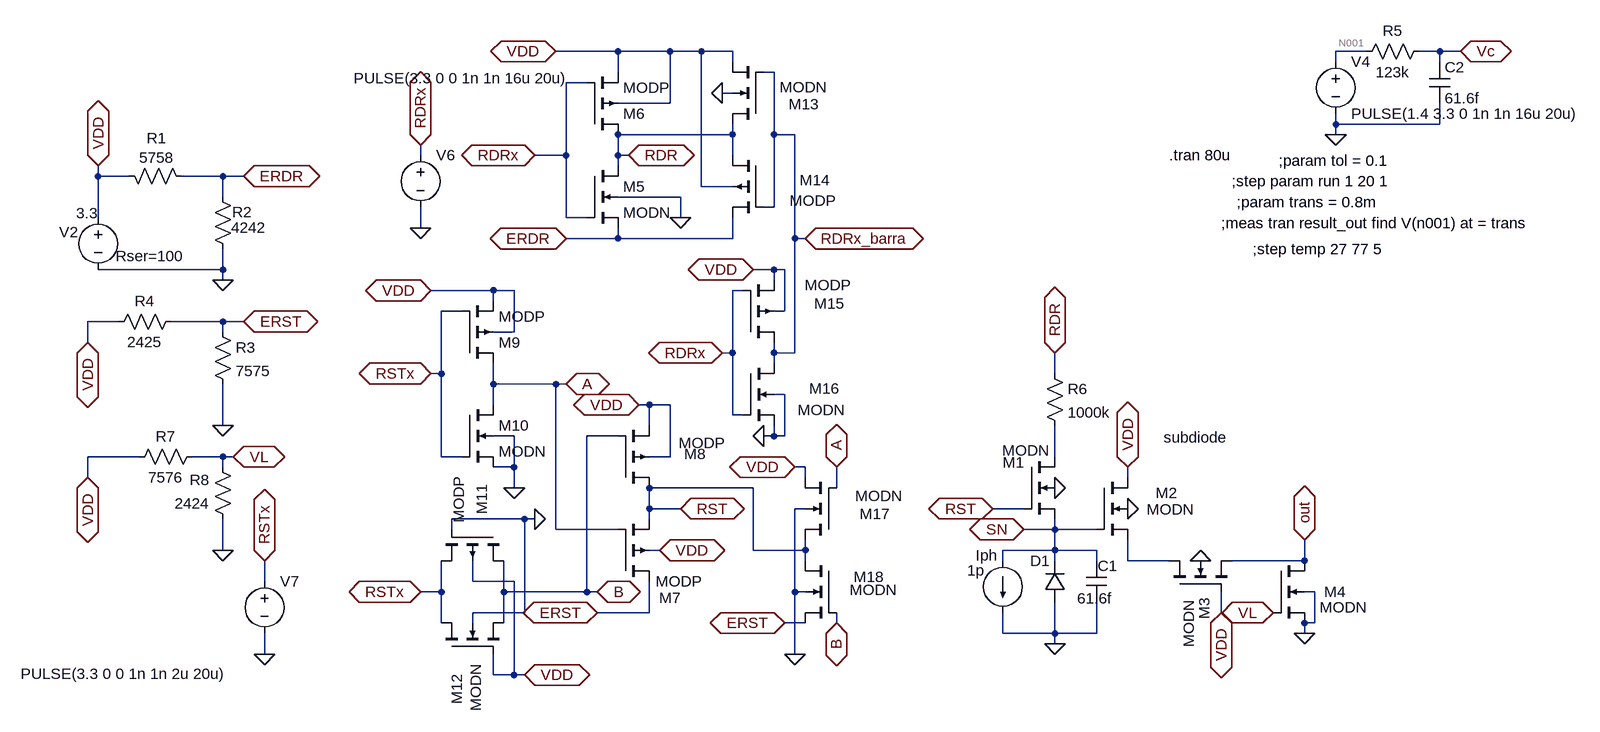
[diagram p0: schematic LIN LOG rdr e rst novo.asc]
LIN LOG rdr e rst novo.asc, the LTspice schematic file:
Version 4
SHEET 1 1868 840
WIRE 336 -5104 240 -5104
WIRE 416 -5104 336 -5104
WIRE 464 -5104 416 -5104
WIRE 512 -5104 464 -5104
WIRE 1488 -5104 1440 -5104
WIRE 1600 -5104 1568 -5104
WIRE 1632 -5104 1600 -5104
WIRE 512 -5088 512 -5104
WIRE 1440 -5088 1440 -5104
WIRE 1600 -5088 1600 -5104
WIRE 336 -5072 336 -5104
WIRE 576 -5072 560 -5072
WIRE 288 -5056 256 -5056
WIRE 512 -5040 496 -5040
WIRE 416 -5024 416 -5104
WIRE 416 -5024 336 -5024
WIRE 1440 -4992 1440 -5008
WIRE 1600 -4992 1600 -5024
WIRE 1600 -4992 1440 -4992
WIRE 512 -4976 512 -4992
WIRE 512 -4976 336 -4976
WIRE 576 -4976 576 -5072
WIRE 608 -4976 576 -4976
WIRE 1440 -4976 1440 -4992
WIRE 32 -4944 32 -4960
WIRE 256 -4944 256 -5056
WIRE 256 -4944 208 -4944
WIRE 336 -4944 336 -4976
WIRE 352 -4944 336 -4944
WIRE 512 -4944 512 -4976
WIRE 336 -4928 336 -4944
WIRE -464 -4912 -464 -4928
WIRE -416 -4912 -464 -4912
WIRE -272 -4912 -336 -4912
WIRE -240 -4912 -272 -4912
WIRE 464 -4896 464 -5104
WIRE 512 -4896 464 -4896
WIRE -272 -4880 -272 -4912
WIRE 432 -4880 336 -4880
WIRE 576 -4864 576 -4976
WIRE 576 -4864 560 -4864
WIRE -464 -4848 -464 -4912
WIRE 256 -4848 256 -4944
WIRE 288 -4848 256 -4848
WIRE 432 -4848 432 -4880
WIRE 32 -4832 32 -4864
WIRE 336 -4816 336 -4832
WIRE 336 -4816 256 -4816
WIRE 512 -4816 512 -4848
WIRE 512 -4816 336 -4816
WIRE 608 -4816 608 -4976
WIRE 624 -4816 608 -4816
WIRE -272 -4768 -272 -4800
WIRE -272 -4768 -464 -4768
WIRE 576 -4768 544 -4768
WIRE 592 -4768 576 -4768
WIRE -272 -4752 -272 -4768
WIRE 576 -4752 576 -4768
WIRE 144 -4736 48 -4736
WIRE 176 -4736 144 -4736
WIRE 528 -4736 512 -4736
WIRE 144 -4720 144 -4736
WIRE 96 -4704 64 -4704
WIRE 592 -4704 592 -4768
WIRE 592 -4704 576 -4704
WIRE -432 -4688 -480 -4688
WIRE -272 -4688 -352 -4688
WIRE -240 -4688 -272 -4688
WIRE -272 -4672 -272 -4688
WIRE 176 -4672 176 -4736
WIRE 176 -4672 144 -4672
WIRE -480 -4656 -480 -4688
WIRE 512 -4640 512 -4736
WIRE 512 -4640 496 -4640
WIRE 576 -4640 576 -4656
WIRE 608 -4640 608 -4816
WIRE 608 -4640 576 -4640
WIRE 576 -4624 576 -4640
WIRE 64 -4608 64 -4704
WIRE 64 -4608 48 -4608
WIRE 1008 -4608 1008 -4640
WIRE 144 -4592 144 -4624
WIRE 240 -4592 144 -4592
WIRE 256 -4592 240 -4592
WIRE 592 -4576 576 -4576
WIRE 144 -4560 144 -4592
WIRE 384 -4560 368 -4560
WIRE 416 -4560 384 -4560
WIRE 512 -4544 512 -4640
WIRE 528 -4544 512 -4544
WIRE -272 -4528 -272 -4592
WIRE 384 -4528 384 -4560
WIRE 176 -4512 144 -4512
WIRE 336 -4512 288 -4512
WIRE 576 -4512 576 -4528
WIRE 576 -4512 560 -4512
WIRE 592 -4512 592 -4576
WIRE 592 -4512 576 -4512
WIRE -400 -4480 -480 -4480
WIRE -272 -4480 -320 -4480
WIRE -256 -4480 -272 -4480
WIRE 64 -4480 64 -4608
WIRE 96 -4480 64 -4480
WIRE 416 -4480 416 -4560
WIRE 416 -4480 384 -4480
WIRE 1008 -4480 1008 -4528
WIRE -272 -4464 -272 -4480
WIRE 176 -4464 176 -4512
WIRE 176 -4464 144 -4464
WIRE 624 -4464 608 -4464
WIRE -480 -4448 -480 -4480
WIRE 624 -4448 624 -4464
WIRE 1120 -4448 1120 -4464
WIRE 176 -4432 176 -4464
WIRE 544 -4432 384 -4432
WIRE 672 -4432 672 -4464
WIRE 384 -4400 384 -4432
WIRE 432 -4400 384 -4400
WIRE 624 -4400 608 -4400
WIRE 960 -4400 912 -4400
WIRE 192 -4384 80 -4384
WIRE 208 -4384 192 -4384
WIRE 384 -4384 384 -4400
WIRE 80 -4368 80 -4384
WIRE 240 -4368 240 -4592
WIRE 336 -4368 240 -4368
WIRE 1008 -4368 1008 -4384
WIRE 1008 -4368 960 -4368
WIRE 1072 -4368 1008 -4368
WIRE -272 -4336 -272 -4384
WIRE 400 -4336 384 -4336
WIRE 544 -4336 544 -4432
WIRE 624 -4336 624 -4352
WIRE 624 -4336 544 -4336
WIRE 1008 -4336 1008 -4368
WIRE 1008 -4336 928 -4336
WIRE 1072 -4336 1008 -4336
WIRE 624 -4320 624 -4336
WIRE 928 -4320 928 -4336
WIRE 1008 -4320 1008 -4336
WIRE 1072 -4320 1072 -4336
WIRE 1120 -4320 1120 -4352
WIRE 1184 -4320 1120 -4320
WIRE 1392 -4320 1392 -4352
WIRE 1392 -4320 1280 -4320
WIRE 1200 -4304 1200 -4320
WIRE -208 -4288 -208 -4320
WIRE 112 -4288 112 -4320
WIRE 176 -4288 112 -4288
WIRE 64 -4272 64 -4320
WIRE 64 -4272 32 -4272
WIRE 160 -4272 160 -4320
WIRE 288 -4272 288 -4512
WIRE 288 -4272 160 -4272
WIRE 304 -4272 288 -4272
WIRE 608 -4272 608 -4400
WIRE 624 -4272 608 -4272
WIRE 1408 -4272 1392 -4272
WIRE 192 -4240 192 -4384
WIRE 192 -4240 112 -4240
WIRE 384 -4240 384 -4288
WIRE 384 -4240 304 -4240
WIRE 1264 -4240 1264 -4272
WIRE 64 -4224 64 -4272
WIRE 112 -4224 112 -4240
WIRE 160 -4224 160 -4272
WIRE 624 -4224 592 -4224
WIRE 672 -4224 672 -4240
WIRE 1392 -4224 1392 -4240
WIRE 1408 -4224 1408 -4272
WIRE 1408 -4224 1392 -4224
WIRE 928 -4208 928 -4240
WIRE 1008 -4208 1008 -4256
WIRE 1008 -4208 928 -4208
WIRE 1072 -4208 1072 -4256
WIRE 1072 -4208 1008 -4208
WIRE 1392 -4208 1392 -4224
WIRE 1008 -4192 1008 -4208
WIRE -208 -4176 -208 -4208
WIRE 608 -4176 608 -4272
WIRE 144 -4144 144 -4176
WIRE 176 -4144 176 -4288
WIRE 176 -4144 144 -4144
WIRE 192 -4144 176 -4144
FLAG 912 -4400 RST
IOPIN 912 -4400 BiDir
FLAG -272 -4752 0
FLAG 1008 -4432 0
FLAG 1008 -4192 0
FLAG 1008 -4640 RDR
IOPIN 1008 -4640 BiDir
FLAG 1120 -4400 0
FLAG 1392 -4208 0
FLAG 1344 -4240 VL
IOPIN 1344 -4240 BiDir
FLAG 1120 -4464 VDD
IOPIN 1120 -4464 BiDir
FLAG 1232 -4320 0
FLAG 1264 -4240 VDD
IOPIN 1264 -4240 BiDir
FLAG 1392 -4352 out
IOPIN 1392 -4352 BiDir
FLAG 960 -4368 SN
IOPIN 960 -4368 BiDir
FLAG -240 -4912 ERDR
IOPIN -240 -4912 BiDir
FLAG 240 -5104 VDD
IOPIN 240 -5104 BiDir
FLAG 432 -4848 0
FLAG 352 -4944 RDR
IOPIN 352 -4944 BiDir
FLAG 208 -4944 RDRx
IOPIN 208 -4944 BiDir
FLAG 256 -4816 ERDR
IOPIN 256 -4816 BiDir
FLAG 32 -4832 0
FLAG 32 -4960 RDRx
IOPIN 32 -4960 BiDir
FLAG 368 -4560 VDD
IOPIN 368 -4560 BiDir
FLAG 432 -4400 RST
IOPIN 432 -4400 BiDir
FLAG 400 -4336 VDD
IOPIN 400 -4336 BiDir
FLAG 304 -4240 ERST
IOPIN 304 -4240 BiDir
FLAG 48 -4736 VDD
IOPIN 48 -4736 BiDir
FLAG 48 -4608 RSTx
IOPIN 48 -4608 BiDir
FLAG 176 -4432 0
FLAG 192 -4144 VDD
IOPIN 192 -4144 BiDir
FLAG 208 -4384 0
FLAG 32 -4272 RSTx
IOPIN 32 -4272 BiDir
FLAG -208 -4320 RSTx
IOPIN -208 -4320 BiDir
FLAG -208 -4176 0
FLAG -272 -4528 0
FLAG -240 -4688 ERST
IOPIN -240 -4688 BiDir
FLAG 1632 -5104 Vc
IOPIN 1632 -5104 BiDir
FLAG 1440 -4976 0
FLAG -480 -4656 VDD
IOPIN -480 -4656 BiDir
FLAG -272 -4336 0
FLAG -480 -4448 VDD
IOPIN -480 -4448 BiDir
FLAG -256 -4480 VL
IOPIN -256 -4480 BiDir
FLAG -464 -4928 VDD
IOPIN -464 -4928 BiDir
FLAG 496 -5040 0
FLAG 544 -4768 VDD
IOPIN 544 -4768 BiDir
FLAG 560 -4512 0
FLAG 624 -4816 RDRx_barra
IOPIN 624 -4816 BiDir
FLAG 496 -4640 RDRx
IOPIN 496 -4640 BiDir
FLAG 608 -4176 0
FLAG 608 -4464 VDD
IOPIN 608 -4464 BiDir
FLAG 256 -4592 A
IOPIN 256 -4592 BiDir
FLAG 672 -4464 A
IOPIN 672 -4464 BiDir
FLAG 304 -4272 B
IOPIN 304 -4272 BiDir
FLAG 672 -4224 B
IOPIN 672 -4224 BiDir
FLAG 592 -4224 ERST
IOPIN 592 -4224 BiDir
SYMBOL voltage -464 -4864 R0
WINDOW 123 0 0 Left 2
WINDOW 39 27 75 Left 2
WINDOW 0 -60 38 Left 2
WINDOW 3 -34 9 Left 2
SYMATTR SpiceLine Rser=100
SYMATTR InstName V2
SYMATTR Value 3.3
SYMBOL nmos4 960 -4480 R0
WINDOW 0 -32 9 Left 2
WINDOW 3 -33 -10 Left 2
SYMATTR InstName M1
SYMATTR Value MODN
SYMATTR Value2 l=0.35u w=0.70u
SYMBOL nmos4 1072 -4448 R0
WINDOW 3 77 49 Left 2
WINDOW 0 91 24 Left 2
SYMATTR Value MODN
SYMATTR InstName M2
SYMATTR Value2 l=0.35u w=0.70u
SYMBOL nmos4 1344 -4320 R0
WINDOW 0 78 48 Left 2
WINDOW 3 71 72 Left 2
SYMATTR InstName M4
SYMATTR Value MODN
SYMATTR Value2 l=0.35u w=0.70u
SYMBOL diode 1024 -4256 R180
WINDOW 0 23 64 Left 2
WINDOW 3 -250 254 Left 2
SYMATTR InstName D1
SYMATTR Value subdiode
SYMBOL current 928 -4320 R0
WINDOW 3 -55 15 Left 2
WINDOW 123 0 0 Left 2
WINDOW 39 0 0 Left 2
WINDOW 0 -42 -8 Left 2
SYMATTR Value 1p
SYMATTR InstName Iph
SYMBOL nmos4 1184 -4272 R270
WINDOW 0 -43 54 Left 2
WINDOW 3 -86 30 Left 2
SYMATTR InstName M3
SYMATTR Value MODN
SYMATTR Value2 l=0.35u w=0.70u
SYMBOL res -432 -4928 M90
WINDOW 0 -27 58 VBottom 2
WINDOW 3 -28 58 VTop 2
SYMATTR InstName R1
SYMATTR Value 5758
SYMBOL res -256 -4784 R180
WINDOW 0 -29 73 Left 2
WINDOW 3 -51 49 Left 2
SYMATTR InstName R2
SYMATTR Value 4242
SYMBOL nmos4 288 -4928 R0
SYMATTR InstName M5
SYMATTR Value MODN
SYMATTR Value2 l=0.35u w=0.70u
SYMBOL pmos4 288 -4976 M180
SYMATTR InstName M6
SYMATTR Value MODP
SYMATTR Value2 l=0.35u w=0.70u
SYMBOL voltage 32 -4960 R0
WINDOW 3 -103 -103 Left 2
WINDOW 123 0 0 Left 2
WINDOW 39 0 0 Left 2
SYMATTR Value PULSE(3.3 0 0 1n 1n 16u 20u)
SYMATTR InstName V6
SYMBOL pmos4 336 -4288 M180
WINDOW 0 63 -25 Left 2
WINDOW 3 58 0 Left 2
SYMATTR InstName M7
SYMATTR Value MODP
SYMATTR Value2 l=0.35u w=0.70u
SYMBOL pmos4 336 -4432 M180
WINDOW 0 102 52 Left 2
WINDOW 3 93 69 Left 2
SYMATTR InstName M8
SYMATTR Value MODP
SYMATTR Value2 l=0.35u w=0.70u
SYMBOL pmos4 96 -4624 M180
SYMATTR InstName M9
SYMATTR Value MODP
SYMATTR Value2 l=0.35u w=0.70u
SYMBOL nmos4 96 -4560 R0
SYMATTR InstName M10
SYMATTR Value MODN
SYMATTR Value2 l=0.35u w=0.70u
SYMBOL pmos4 160 -4368 R90
WINDOW 0 -70 34 Left 2
WINDOW 3 -82 69 Left 2
SYMATTR InstName M11
SYMATTR Value MODP
SYMATTR Value2 l=0.35u w=0.70u
SYMBOL nmos4 64 -4176 R270
WINDOW 0 -77 24 Left 2
WINDOW 3 -88 53 Left 2
SYMATTR InstName M12
SYMATTR Value MODN
SYMATTR Value2 l=0.35u w=0.70u
SYMBOL voltage -208 -4304 R0
WINDOW 3 -375 158 Left 2
WINDOW 123 0 0 Left 2
WINDOW 39 0 0 Left 2
SYMATTR Value PULSE(3.3 0 0 1n 1n 2u 20u)
SYMATTR InstName V7
SYMBOL res -288 -4688 R0
SYMATTR InstName R3
SYMATTR Value 7575
SYMBOL res -336 -4704 R90
WINDOW 0 0 56 VBottom 2
WINDOW 3 32 56 VTop 2
SYMATTR InstName R4
SYMATTR Value 2425
SYMBOL cap 1056 -4320 R0
WINDOW 3 -14 58 Left 2
WINDOW 0 18 8 Left 2
SYMATTR Value 61.6f
SYMATTR InstName C1
SYMBOL res 1584 -5120 R90
WINDOW 0 0 56 VBottom 2
WINDOW 3 32 56 VTop 2
SYMATTR InstName R5
SYMATTR Value 123k
SYMBOL cap 1584 -5088 R0
SYMATTR InstName C2
SYMATTR Value 61.6f
SYMBOL voltage 1440 -5104 R0
WINDOW 123 0 0 Left 2
WINDOW 39 0 0 Left 2
SYMATTR InstName V4
SYMATTR Value PULSE(1.4 3.3 0 1n 1n 16u 20u)
SYMBOL res -304 -4496 R90
WINDOW 0 0 56 VBottom 2
WINDOW 3 32 56 VTop 2
SYMATTR InstName R7
SYMATTR Value 7576
SYMBOL res -256 -4368 R180
WINDOW 0 36 76 Left 2
WINDOW 3 36 40 Left 2
SYMATTR InstName R8
SYMATTR Value 2424
SYMBOL res 992 -4624 R0
SYMATTR InstName R6
SYMATTR Value 1000k
SYMBOL nmos4 560 -4992 R180
WINDOW 0 -86 31 Left 2
WINDOW 3 -98 57 Left 2
SYMATTR InstName M13
SYMATTR Value MODN
SYMATTR Value2 l=0.35u w=0.7u
SYMBOL pmos4 560 -4944 M0
WINDOW 0 -103 38 Left 2
WINDOW 3 -112 70 Left 2
SYMATTR InstName M14
SYMATTR Value MODP
SYMATTR Value2 l=0.35u w=0.7u
SYMBOL pmos4 528 -4656 M180
WINDOW 0 110 60 Left 2
WINDOW 3 95 88 Left 2
SYMATTR InstName M15
SYMATTR Value MODP
SYMATTR Value2 l=0.35u w=0.7u
SYMBOL nmos4 528 -4624 R0
WINDOW 0 102 39 Left 2
WINDOW 3 84 72 Left 2
SYMATTR InstName M16
SYMATTR Value MODN
SYMATTR Value2 l=0.35u w=0.7u
SYMBOL nmos4 672 -4352 R180
WINDOW 0 -83 40 Left 2
WINDOW 3 -102 68 Left 2
SYMATTR InstName M17
SYMATTR Value MODN
SYMATTR Value2 l=0.35u w=0.7u
SYMBOL nmos4 672 -4320 M0
WINDOW 0 -74 25 Left 2
WINDOW 3 -94 45 Left 2
SYMATTR InstName M18
SYMATTR Value MODN
SYMATTR Value2 l=0.35u w=0.7u
TEXT 1184 -4944 Left 2 !.tran 80u
TEXT 1352 -4936 Left 2 !;param tol = 0.1
TEXT 1280 -4904 Left 2 !;step param run 1 20 1
TEXT 1288 -4872 Left 2 !;param trans = 0.8m
TEXT 1264 -4840 Left 2 !;meas tran result_out find V(n001) at = trans
TEXT 1312 -4800 Left 2 !;step temp 27 77 5

The netlist it stands for:
* LIN LOG rdr e rst novo.asc
V2 VDD 0 3.3 Rser=100
M1 N002 RST SN 0 MODN l=0.35u w=0.70u
M2 VDD SN N003 0 MODN l=0.35u w=0.70u
M4 out VL 0 0 MODN l=0.35u w=0.70u
D1 0 SN subdiode
Iph SN 0 1p
M3 N003 VDD out 0 MODN l=0.35u w=0.70u
R1 VDD ERDR 5758
R2 0 ERDR 4242
M5 RDR RDRx ERDR 0 MODN l=0.35u w=0.70u
M6 RDR RDRx VDD VDD MODP l=0.35u w=0.70u
V6 RDRx 0 PULSE(3.3 0 0 1n 1n 16u 20u)
M7 ERST A RST VDD MODP l=0.35u w=0.70u
M8 RST B VDD VDD MODP l=0.35u w=0.70u
M9 A RSTx VDD VDD MODP l=0.35u w=0.70u
M10 A RSTx 0 0 MODN l=0.35u w=0.70u
M11 B 0 RSTx VDD MODP l=0.35u w=0.70u
M12 RSTx VDD B 0 MODN l=0.35u w=0.70u
V7 RSTx 0 PULSE(3.3 0 0 1n 1n 2u 20u)
R3 ERST 0 7575
R4 ERST VDD 2425
C1 SN 0 61.6f
R5 Vc N001 123k
C2 Vc 0 61.6f
V4 N001 0 PULSE(1.4 3.3 0 1n 1n 16u 20u)
R7 VL VDD 7576
R8 0 VL 2424
R6 RDR N002 1000k
M13 RDR RDRx_barra VDD 0 MODN l=0.35u w=0.7u
M14 RDR RDRx_barra ERDR VDD MODP l=0.35u w=0.7u
M15 RDRx_barra RDRx VDD VDD MODP l=0.35u w=0.7u
M16 RDRx_barra RDRx 0 0 MODN l=0.35u w=0.7u
M17 RST A VDD 0 MODN l=0.35u w=0.7u
M18 RST B ERST 0 MODN l=0.35u w=0.7u
.model D D
.lib standard.dio
.model NMOS NMOS
.model PMOS PMOS
.lib standard.mos
.tran 80u
;param tol = 0.1
;step param run 1 20 1
;param trans = 0.8m
;meas tran result_out find V(n001) at = trans
;step temp 27 77 5
.backanno
.end